# EAGLE design Driver Pic 2550 (EAGLE 6.2)

## Sheet 1 of 2
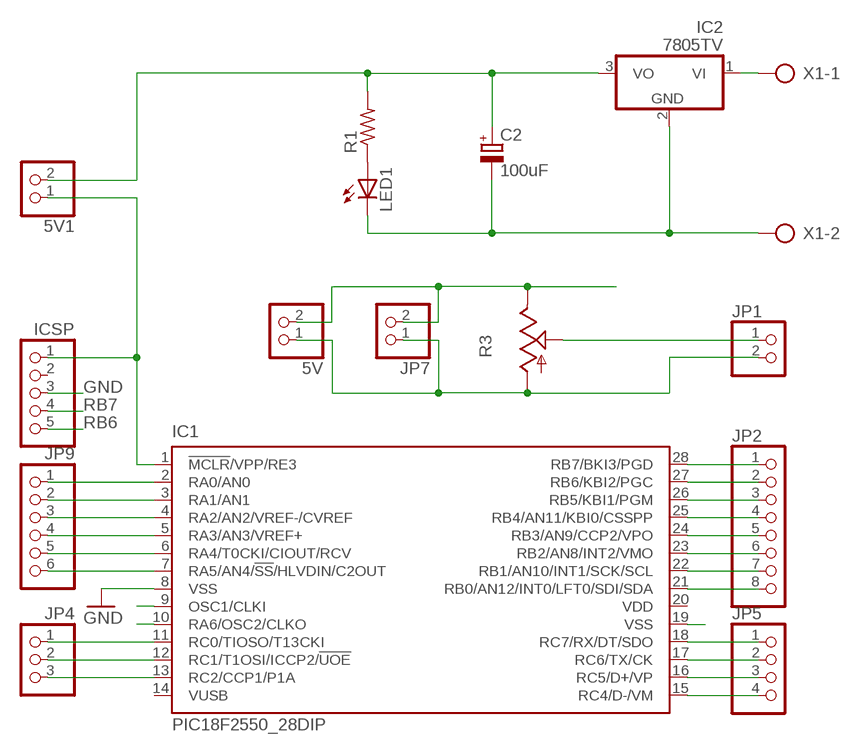
[diagram p0: schematic, sheet 1]

### Parts
5V  PINHD-1X2  [1X02]
5V1  PINHD-1X2  [1X02]
C2  100uF  CPOL-EUE2,5-6E  [E2,5-6E]
IC1  PIC18F2550_28DIP  [DIL28-3]
IC2  7805TV  [TO220V]
ICSP  PINHD-1X5/90  [1X05/90]
JP1  PINHD-1X2  [1X02]
JP2  PINHD-1X8  [1X08]
JP4  PINHD-1X3  [1X03]
JP5  PINHD-1X4  [1X04]
JP7  PINHD-1X2  [1X02]
JP9  PINHD-1X6  [1X06]
LED1  LED3MM  [LED3MM]
R1  R-US_0207/2V  [0207/2V]
R3  TRIM_US-B64W  [B64W]
X1  AK300/2  [AK300/2]

### Nets
AN0: IC1.2(RA0/AN0) JP9.1 ; also sheet 2
D+: IC1.16(RC5/D+/VP) JP5.3
D-: IC1.15(RC4/D-/VM) JP5.4
GND: 5V.1 C2.- IC1.8(VSS) IC1.19(VSS) IC2.2(GND) ICSP.3 JP1.2 JP7.1 LED1.K(C) R3.A X1.2 ; also sheet 2
N$1: IC1.7(RA5/AN4/!SS!/HLVDIN/C2OUT) JP9.6
N$2: 5V1.1 IC1.1(!MCLR!/VPP/RE3) ICSP.1
N$3: LED1.A R1.1
N$4: IC1.6(RA4/T0CKI/CIOUT/RCV) JP9.5
N$5: IC1.5(RA3/AN3/VREF+) JP9.4
N$6: IC1.4(RA2/AN2/VREF-/CVREF) JP9.3
N$8: IC1.26(RB5/KBI1/PGM) JP2.3
N$9: IC1.25(RB4/AN11/KBI0/CSSPP) JP2.4
N$10: IC1.24(RB3/AN9/CCP2/VPO) JP2.5
N$12: JP1.1 R3.S
N$14: IC1.3(RA1/AN1) JP9.2
N$15: IC1.13(RC2/CCP1/P1A) JP4.3
N$16: IC1.11(RC0/TIOSO/T13CKI) JP4.1
N$17: IC1.12(RC1/T1OSI/ICCP2/!UOE) JP4.2
N$18: IC2.1(VI) X1.1
N$19: IC1.18(RC7/RX/DT/SDO) JP5.1
N$20: IC1.17(RC6/TX/CK) JP5.2
OSC1: IC1.9(OSC1/CLKI)
OSC2: IC1.10(RA6/OSC2/CLKO)
RB0: IC1.21(RB0/AN12/INT0/LFT0/SDI/SDA) JP2.8
RB1: IC1.22(RB1/AN10/INT1/SCK/SCL) JP2.7
RB2: IC1.23(RB2/AN8/INT2/VMO) JP2.6
RB6: IC1.27(RB6/KBI2/PGC) ICSP.5 JP2.2
RB7: IC1.28(RB7/BKI3/PGD) ICSP.4 JP2.1
VDD: 5V1.2 5V.2 C2.+ IC2.3(VO) JP7.2 R1.2 R3.E ; also sheet 2
Unconnected: IC1.14(VUSB) ICSP.2

## Sheet 2 of 2
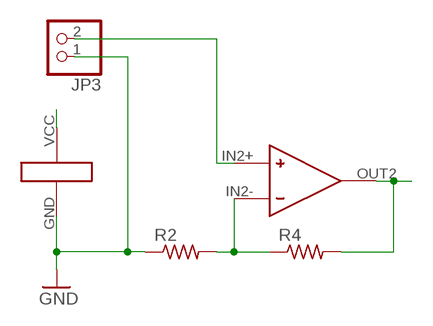
[diagram p1: schematic, sheet 2]

### Parts
JP3  PINHD-1X2  [1X02]
R2  R-US_0204/7  [0204/7]
R4  R-US_0204/7  [0204/7]
U$1  LM358  [LM358]

### Nets
AN0: R4.2 U$1.OUT2(OPAMP2:OUT) ; also sheet 1
GND: JP3.1 R2.1 U$1.GND(POWER:GND) ; also sheet 1
N$7: JP3.2 U$1.IN2+(OPAMP2:IN+)
N$11: R2.2 R4.1 U$1.IN2-(OPAMP2:IN-)
VDD: U$1.VCC(POWER:VCC) ; also sheet 1
Unconnected: U$1.IN1+(OPAMP1:IN+) U$1.IN1-(OPAMP1:IN-) U$1.OUT1(OPAMP1:OUT)

## Power pins joined to a net without a drawn wire
VDD: IC1.20(VDD)

## Library data of the parts
5V 5V1 JP1 JP3 JP7 = pinhead:PINHD-1X2: PIN HEADER
C2 = resistor:CPOL-EU: POLARIZED CAPACITOR, European symbol
IC1 = microchip:PIC18F2*_28: USB Microcontrollers with nanoWatt Technology High-Performance, Enhanced Flash, 28/40/44-Pin, Source: http://ww1.microchip.com/downloads/en/devicedoc/39632c.pdf; MF: MICROCHIP; MPN: PIC18F2550-I/SP; OC_FARNELL: 1523822; OC_NEWARK: 80K6054
IC2 = linear:78*: Positive VOLTAGE REGULATOR Source: http://cache.national.com/ds/LM/LM78L05.pdf http://www.fairchildsemi.com/ds/LM/LM7805.pdf
ICSP = pinhead:PINHD-1X5: PIN HEADER
JP2 = pinhead:PINHD-1X8: PIN HEADER
JP4 = pinhead:PINHD-1X3: PIN HEADER
JP5 = pinhead:PINHD-1X4: PIN HEADER
JP9 = pinhead:PINHD-1X6: PIN HEADER
LED1 = led:LED: LED OSRAM: - CHIPLED LG R971, LG N971, LY N971, LG Q971, LY Q971, LO R971, LY R971 LH N974, LH R974 LS Q976, LO Q976, LY Q976 LO Q996 - Hyper CHIPLED LW Q18S LB Q993, LB Q99A, LB R99A - SideLED LS A670, LO A670, LY A670, LG A670, LP A670 LB A673, LV A673, LT A673, LW A673 LH A674 LY A675 LS A676, LA A676, LO A676, LY A676, LW A676 LS A679, LY A679, LG A679 - Hyper Micro SIDELED® LS Y876, LA Y876, LO Y876, LY Y876 LT Y87S - SmartLED LW L88C, LW L88S LB L89C, LB L89S, LG L890 LS L89K, LO L89K, LY L89K LS L896, LA L896, LO L896, LY L896 - TOPLED LS T670, LO T670, LY T670, LG T670, LP T670 LSG T670, LSP T670, LSY T670, LOP T670, LYG T670 LG T671, LOG T671, LSG T671 LB T673, LV T673, LT T673, LW T673 LH T674 LS T676, LA T676, LO T676, LY T676, LB T676, LH T676, LSB T676, LW T676 LB T67C, LV T67C, LT T67C, LS T67K, LO T67K, LY T67K, LW E67C LS E67B, LA E67B, LO E67B, LY E67B, LB E67C, LV E67C, LT E67C LW T67C LS T679, LY T679, LG T679 LS T770, LO T770, LY T770, LG T770, LP T770 LB T773, LV T773, LT T773, LW T773 LH T774 LS E675, LA E675, LY E675, LS T675 LS T776, LA T776, LO T776, LY T776, LB T776 LHGB T686 LT T68C, LB T68C - Hyper Mini TOPLED® LB M676 - Mini TOPLED Santana® LG M470 LS M47K, LO M47K, LY M47K Source: http://www.osram.convergy.de LUXEON: - LUMILED® LXK2-PW12-R00, LXK2-PW12-S00, LXK2-PW14-U00, LXK2-PW14-V00 LXK2-PM12-R00, LXK2-PM12-S00, LXK2-PM14-U00 LXK2-PE12-Q00, LXK2-PE12-R00, LXK2-PE12-S00, LXK2-PE14-T00, LXK2-PE14-U00 LXK2-PB12-K00, LXK2-PB12-L00, LXK2-PB12-M00, LXK2-PB14-N00, LXK2-PB14-P00, LXK2-PB14-Q00 LXK2-PR12-L00, LXK2-PR12-M00, LXK2-PR14-Q00, LXK2-PR14-R00 LXK2-PD12-Q00, LXK2-PD12-R00, LXK2-PD12-S00 LXK2-PH12-R00, LXK2-PH12-S00 LXK2-PL12-P00, LXK2-PL12-Q00, LXK2-PL12-R00 Source: www.luxeon.com KINGBRIGHT: KA-3528ASYC Source: www.kingbright.com
R1 R2 R4 = resistor:R-US_: RESISTOR, American symbol
R3 = pot:TRIM_US-: POTENTIOMETER
U$1 = CustumLib:LM358
X1 = con-ptr500:AK300/2: CONNECTOR; OC_FARNELL: unknown; OC_NEWARK: unknown

## Board
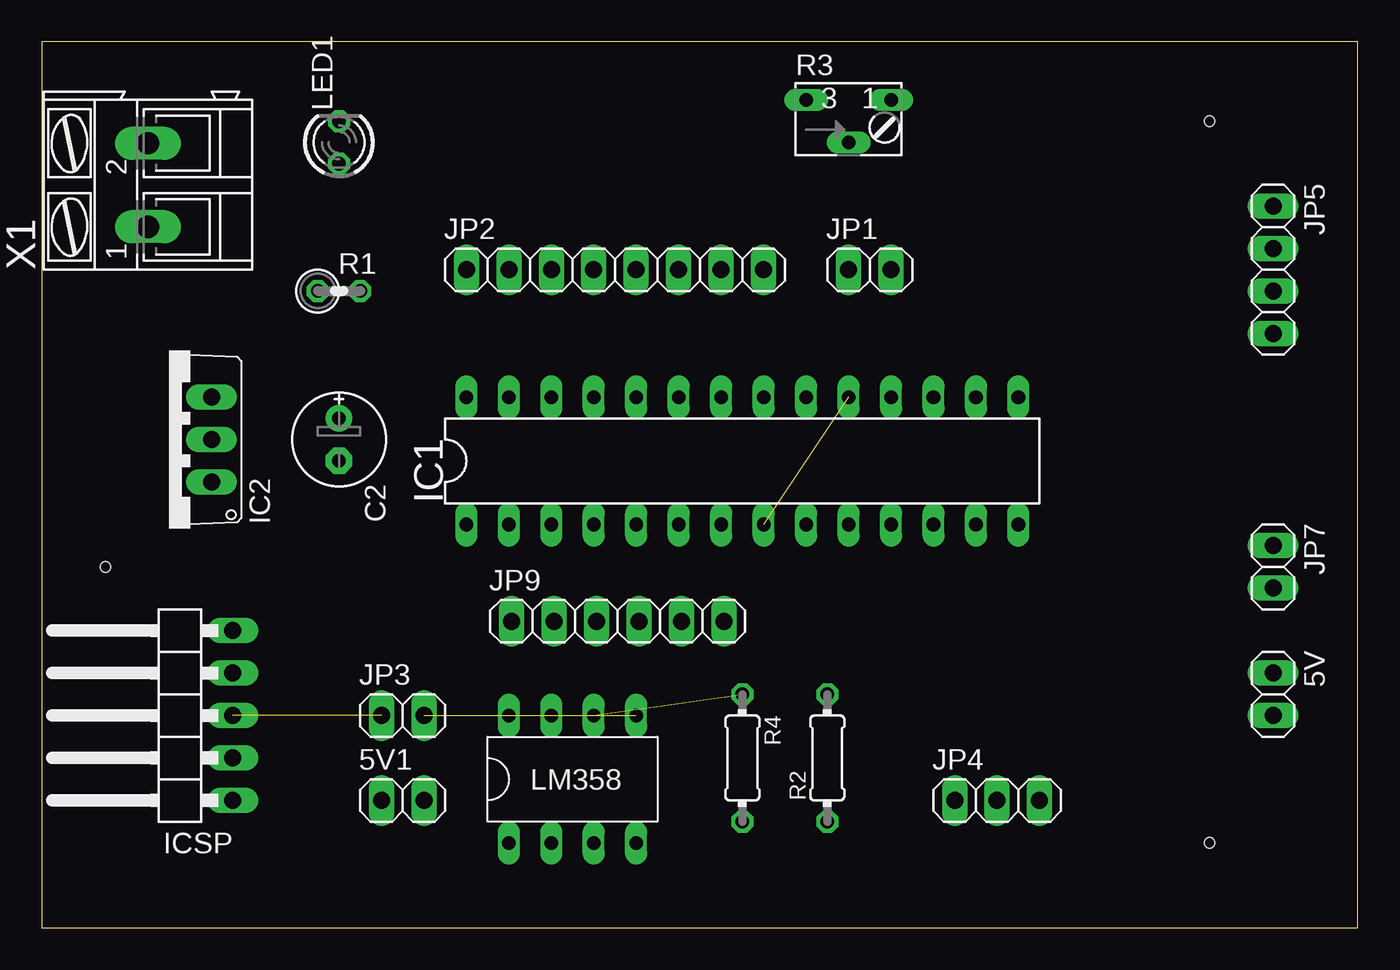
[diagram p2: board, top side]
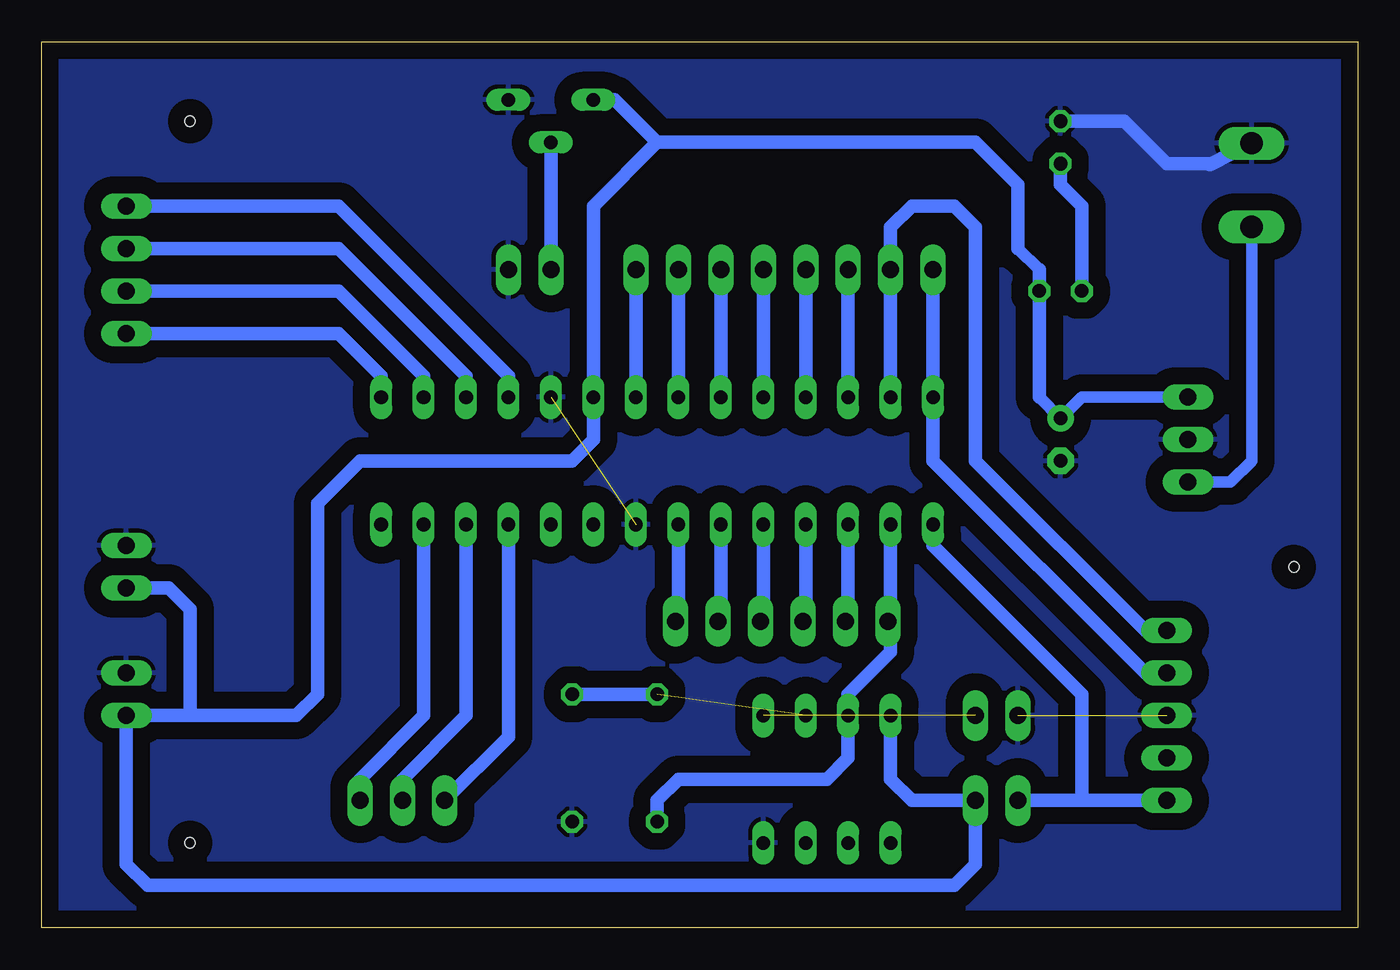
[diagram p3: board, bottom side, seen from below]

Size 78.72 x 53.01 mm. Coordinates in mm from the lower left corner, seen from the top.
Outline: 0,0 78.72,0 78.72,53.01 0,53.01 0,0
Copper layers (1*16): Top 0.035mm / dielectric 1.5mm / Bottom 0.035mm
Design rules: minimum track width 10mil, minimum drill 24mil, track to track 8mil, track to pad 8mil, pad to pad 8mil, via to via 8mil, smd to smd 8mil, copper to edge 40mil, drill to drill 8mil, minimum pad ring 10mil, minimum via ring 8mil, stop-mask expansion 4mil, vias tented up to drill 0mil, thermal gap 10mil
Holes 0.6 mm at 69.85,48.26 69.85,5.08 3.81,21.59

### Footprints (pad centres in the part's own frame; a part is rotated, then mirrored left to right if it is on the bottom)
1X02 = drill 1.016 long: 1 -1.27,0; 2 1.27,0
E2,5-6E = drill 0.813 pad 1.575: + -1.27,0 | drill 0.813 pad 1.575 octagon: - 1.27,0
DIL28-3 = drill 0.813 long: 1 -16.51,-3.81; 2 -13.97,-3.81; 3 -11.43,-3.81; 4 -8.89,-3.81; 5 -6.35,-3.81; 6 -3.81,-3.81; 7 -1.27,-3.81; 8 1.27,-3.81; 9 3.81,-3.81; 10 6.35,-3.81; 11 8.89,-3.81; 12 11.43,-3.81; 13 13.97,-3.81; 14 16.51,-3.81; 15 16.51,3.81; 16 13.97,3.81; 17 11.43,3.81; 18 8.89,3.81; 19 6.35,3.81; 20 3.81,3.81; 21 1.27,3.81; 22 -1.27,3.81; 23 -3.81,3.81; 24 -6.35,3.81; 25 -8.89,3.81; 26 -11.43,3.81; 27 -13.97,3.81; 28 -16.51,3.81
TO220V = drill 1.016 long: 1 -2.54,-2.54; 2 0,-2.54; 3 2.54,-2.54
1X05/90 = drill 1.016 long: 1 -5.08,-3.81; 2 -2.54,-3.81; 3 0,-3.81; 4 2.54,-3.81; 5 5.08,-3.81
1X08 = drill 1.016 long: 1 -8.89,0; 2 -6.35,0; 3 -3.81,0; 4 -1.27,0; 5 1.27,0; 6 3.81,0; 7 6.35,0; 8 8.89,0
1X03 = drill 1.016 long: 1 -2.54,0; 2 0,0; 3 2.54,0
1X04 = drill 1.016 long: 1 -3.81,0; 2 -1.27,0; 3 1.27,0; 4 3.81,0
1X06 = drill 1.016 long: 1 -6.35,0; 2 -3.81,0; 3 -1.27,0; 4 1.27,0; 5 3.81,0; 6 6.35,0
LED3MM = drill 0.813 octagon: A -1.27,0; K 1.27,0
0207/2V = drill 0.813 octagon: 1 -1.27,0; 2 1.27,0
0204/7 = drill 0.813 octagon: 1 -3.81,0; 2 3.81,0
B64W = drill 0.813 long: A 2.54,0; E -2.54,0; S 0,-2.54
LM358 = drill 0.8 long: GND 3.81,-3.81; IN1+ 1.27,-3.81; IN1- -1.27,-3.81; IN2+ 3.81,3.81; IN2- 1.27,3.81; OUT1 -3.81,-3.81; OUT2 -1.27,3.81; VCC -3.81,3.81
AK300/2 = drill 1.321 long: 1 -2.515,0; 2 2.489,0

### Placement (x,y rotation side)
5V  73.66,13.97 270 top
5V1  21.59,7.62 0 top
C2  17.78,29.21 270 top
IC1  41.91,27.94 0 top
IC2  7.62,29.21 90 top
ICSP  7.62,12.7 90 top
JP1  49.53,39.37 0 top
JP2  34.29,39.37 0 top
JP3  21.59,12.7 0 top
JP4  57.15,7.62 0 top
JP5  73.66,39.37 270 top
JP7  73.66,21.59 270 top
JP9  34.45,18.34 0 top
LED1  17.78,46.99 90 top
R1  17.78,38.1 0 top
R2  46.99,10.16 90 top
R3  48.26,49.53 0 top
R4  41.91,10.16 270 top
U$1  31.75,8.89 0 top
X1  6.35,44.45 90 top

### Tracks (layer width: path | path; a pad name or v marks a point on that pad's centre or on a via)
AN0
  Bottom 0.813: IC1.2 27.94,18.5 | 27.94,18.5 JP9.1 | 27.94,18.5 27.94,16.51 30.48,13.97 U$1.OUT2 30.48,10.16 31.75,8.89 40.64,8.89 41.91,7.62 R4.2
D+
  Bottom 0.813: JP5.3 60.96,38.1 55.88,33.02 IC1.16
D-
  Bottom 0.813: JP5.4 60.96,35.56 58.42,33.02 IC1.15
GND  (2 unrouted)
  Bottom 0.813: X1.2 8.84,45.67 8.89,45.72 11.43,45.72 13.97,48.26 LED1.K
  pour Bottom (isolate 1.016): 0,0 0,52.99 78.74,52.99 78.74,0
N$1
  Bottom 0.813: IC1.7 40.64,18.5 JP9.6
N$2
  Bottom 0.813: ICSP.1 16.51,7.62 | 16.51,7.62 5V1.1 | IC1.1 25.4,22.86 16.51,13.97 16.51,7.62
N$3
  Bottom 0.813: LED1.A 17.78,44.45 16.51,43.18 R1.1
N$4
  Bottom 0.813: IC1.6 38.1,18.5 JP9.5
N$5
  Bottom 0.813: IC1.5 35.56,18.5 JP9.4
N$6
  Bottom 0.813: IC1.4 33.02,18.5 JP9.3
N$7  (1 unrouted)
N$8
  Bottom 0.813: JP2.3 IC1.26
N$9
  Bottom 0.813: JP2.4 IC1.25
N$10
  Bottom 0.813: JP2.5 IC1.24
N$11  (1 unrouted)
  Bottom 0.813: R4.1 R2.2
N$12
  Bottom 0.813: R3.S JP1.1
N$14
  Bottom 0.813: IC1.3 30.48,18.5 JP9.2
N$15
  Bottom 0.813: IC1.13 55.88,12.7 59.69,8.89 JP4.3
N$16
  Bottom 0.813: IC1.11 50.8,11.43 JP4.1
N$17
  Bottom 0.813: IC1.12 53.34,12.7 57.15,8.89 JP4.2
N$18
  Bottom 0.7: X1.1 6.35,27.94 7.62,26.67 IC2.1
N$19
  Bottom 0.813: JP5.1 60.96,43.18 50.8,33.02 IC1.18
N$20
  Bottom 0.813: JP5.2 60.96,40.64 53.34,33.02 IC1.17
RB0
  Bottom 0.813: JP2.8 IC1.21
RB1
  Bottom 0.813: JP2.7 IC1.22
RB2
  Bottom 0.813: JP2.6 IC1.23
RB6
  Bottom 0.813: IC1.27 JP2.2 27.94,41.91 26.67,43.18 24.13,43.18 22.86,41.91 22.86,27.94 12.7,17.78 ICSP.5
RB7
  Bottom 0.813: JP2.1 IC1.28 25.4,27.94 12.7,15.24 ICSP.4
VDD
  Bottom 0.7: 19.05,39.37 20.32,40.64 | IC2.3 16.51,31.75 C2.+ 19.05,31.75
  Bottom 0.813: 19.05,31.75 R1.2 19.05,39.37 | 20.32,40.64 20.32,44.45 22.86,46.99 41.91,46.99 | 69.85,12.7 5V.2 73.66,3.81 72.39,2.54 24.13,2.54 22.86,3.81 5V1.2 26.67,7.62 27.94,8.89 U$1.VCC | 69.85,12.7 63.5,12.7 62.23,13.97 62.23,25.4 59.69,27.94 46.99,27.94 45.72,29.21 IC1.20 45.72,43.18 41.91,46.99 | R3.E 44.45,49.53 41.91,46.99 | JP7.2 71.12,20.32 69.85,19.05 69.85,12.7

### Text on the board
Labels: DISPLAY/ DIGITAL | GND | C7 | B7 | B6 | B5 | B4 | B3 | B2 | B1 | B0 | C6 | C5 | RELES | 330 | C4 | 100uF | LM7805 | PIC 18F2550 | GND | A0 | A1 | A2 | A3 | A4 | A5 | VDD | GND | VDD | ICSP | MCLR | Rev. 1 | C0 | C1 | C2